# EAGLE design dali_adapter (EAGLE 9.5.2)
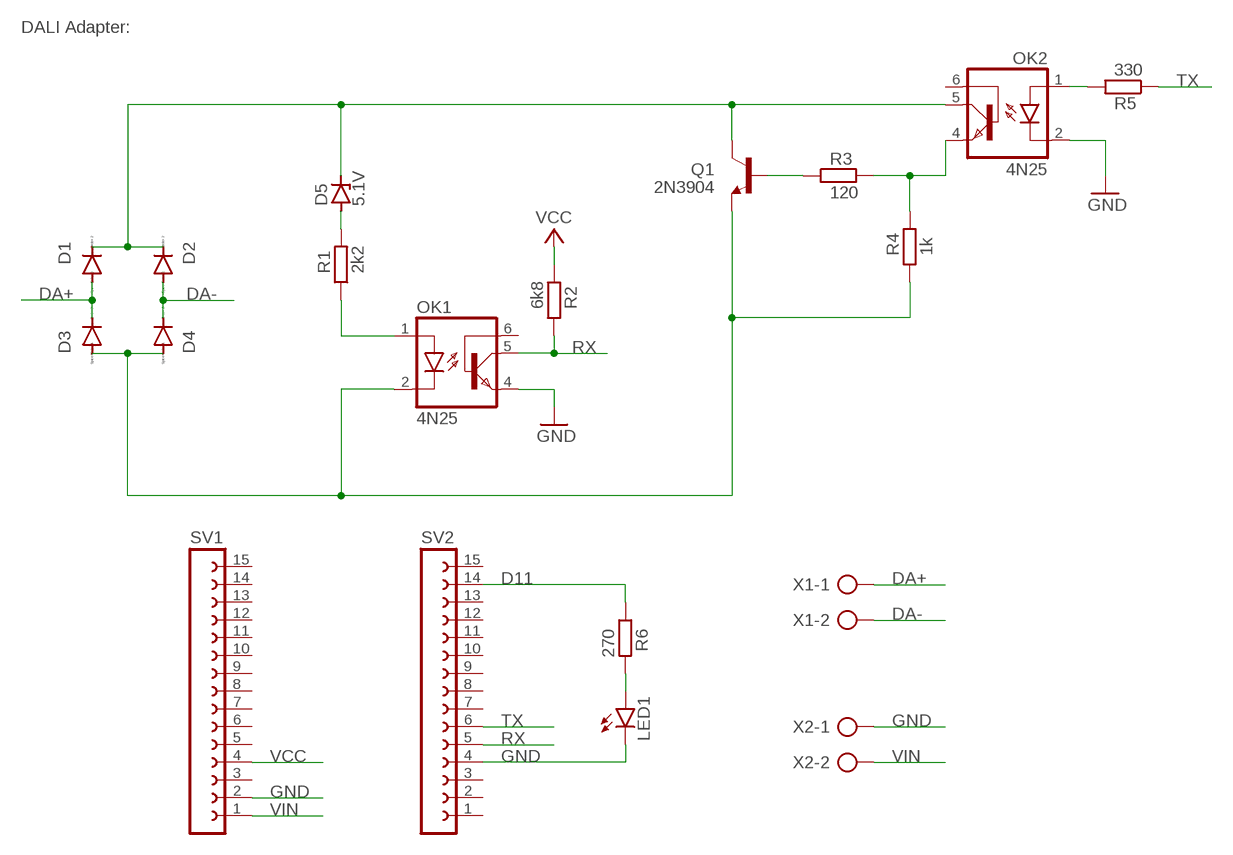
[diagram p0: schematic, sheet 1]

## Parts
D1  1N4004  [DO41-10]
D2  1N4004  [DO41-10]
D3  1N4004  [DO41-10]
D4  1N4004  [DO41-10]
D5  5.1V  ZENER-DIODEDO35Z10  [DO35Z10]
LED1  LED5MM  [LED5MM]
OK1  4N25  4N25M  [DIL06]
OK2  4N25  4N25M  [DIL06]
Q1  2N3904  BC449  [TO92-EBC]
R1  2k2  R-EU_0207/10  [0207/10]
R2  6k8  R-EU_0207/10  [0207/10]
R3  120  R-EU_0207/10  [0207/10]
R4  1k  R-EU_0207/10  [0207/10]
R5  330  R-EU_0207/10  [0207/10]
R6  270  R-EU_0207/10  [0207/10]
SV1  FE15-1  [FE15]
SV2  FE15-1  [FE15]
X1  AK500/2  [AK500/2]
X2  AK500/2  [AK500/2]

## Nets
D11: R6.1 SV2.14
DA+: D1.A D3.C X1.1
DA-: D2.A D4.C X1.2
GND: LED1.K(C) OK1.4(EMI) OK2.2(C) SV1.2 SV2.4 X2.1
N$1: LED1.A R6.2
N$3: D3.A D4.A OK1.2(C) Q1.E R4.1
N$4: OK1.1(A) R1.1
N$5: OK2.4(EMI) R3.2 R4.2
N$6: Q1.B R3.1
N$7: OK2.1(A) R5.2
N$9: D5.A R1.2
N$13: D1.C D2.C D5.C OK2.5(COL) Q1.C
RX: OK1.5(COL) R2.2 SV2.5
TX: R5.1 SV2.6
VCC: R2.1 SV1.4
VIN: SV1.1 X2.2
Unconnected: OK1.6(BAS) OK2.6(BAS) SV1.3 SV1.5 SV1.6 SV1.7 SV1.8 SV1.9 SV1.10 SV1.11 SV1.12 SV1.13 SV1.14 SV1.15 SV2.1 SV2.2 SV2.3 SV2.7 SV2.8 SV2.9 SV2.10 SV2.11 SV2.12 SV2.13 SV2.15

## Notes on the sheet
- DALI Adapter:

## Library data of the parts
D1-D4 = diode:1N4004: DIODE general purpose rectifier, 1 A
D5 = diode:ZENER-DIODE: Z-Diode
LED1 = led:LED: LED OSRAM: - CHIPLED LG R971, LG N971, LY N971, LG Q971, LY Q971, LO R971, LY R971 LH N974, LH R974 LS Q976, LO Q976, LY Q976 LO Q996 - Hyper CHIPLED LW Q18S LB Q993, LB Q99A, LB R99A - SideLED LS A670, LO A670, LY A670, LG A670, LP A670 LB A673, LV A673, LT A673, LW A673 LH A674 LY A675 LS A676, LA A676, LO A676, LY A676, LW A676 LS A679, LY A679, LG A679 - Hyper Micro SIDELED® LS Y876, LA Y876, LO Y876, LY Y876 LT Y87S - SmartLED LW L88C, LW L88S LB L89C, LB L89S, LG L890 LS L89K, LO L89K, LY L89K LS L896, LA L896, LO L896, LY L896 - TOPLED LS T670, LO T670, LY T670, LG T670, LP T670 LSG T670, LSP T670, LSY T670, LOP T670, LYG T670 LG T671, LOG T671, LSG T671 LB T673, LV T673, LT T673, LW T673 LH T674 LS T676, LA T676, LO T676, LY T676, LB T676, LH T676, LSB T676, LW T676 LB T67C, LV T67C, LT T67C, LS T67K, LO T67K, LY T67K, LW E67C LS E67B, LA E67B, LO E67B, LY E67B, LB E67C, LV E67C, LT E67C LW T67C LS T679, LY T679, LG T679 LS T770, LO T770, LY T770, LG T770, LP T770 LB T773, LV T773, LT T773, LW T773 LH T774 LS E675, LA E675, LY E675, LS T675 LS T776, LA T776, LO T776, LY T776, LB T776 LHGB T686 LT T68C, LB T68C - Hyper Mini TOPLED® LB M676 - Mini TOPLED Santana® LG M470 LS M47K, LO M47K, LY M47K Source: http://www.osram.convergy.de LUXEON: - LUMILED® LXK2-PW12-R00, LXK2-PW12-S00, LXK2-PW14-U00, LXK2-PW14-V00 LXK2-PM12-R00, LXK2-PM12-S00, LXK2-PM14-U00 LXK2-PE12-Q00, LXK2-PE12-R00, LXK2-PE12-S00, LXK2-PE14-T00, LXK2-PE14-U00 LXK2-PB12-K00, LXK2-PB12-L00, LXK2-PB12-M00, LXK2-PB14-N00, LXK2-PB14-P00, LXK2-PB14-Q00 LXK2-PR12-L00, LXK2-PR12-M00, LXK2-PR14-Q00, LXK2-PR14-R00 LXK2-PD12-Q00, LXK2-PD12-R00, LXK2-PD12-S00 LXK2-PH12-R00, LXK2-PH12-S00 LXK2-PL12-P00, LXK2-PL12-Q00, LXK2-PL12-R00 Source: www.luxeon.com KINGBRIGHT: KA-3528ASYC Source: www.kingbright.com
OK1 OK2 = optocoupler:4N*?M: General Purpose 6-Pin Phototransistor Optocouplers Source: http://www.fairchildsemi.com/ds/4N/4N35-M.pdf; MPN: 4N25-M; OC_FARNELL: 1021349; OC_NEWARK: 98K9084
Q1 = transistor-npn:BC449*: NPN Transistor
R1-R6 = rcl:R-EU_: RESISTOR, European symbol; SPICEPREFIX: R
SV1 SV2 = con-lsta:FE15-1: FEMALE HEADER; OC_FARNELL: unknown; OC_NEWARK: unknown
X1 X2 = con-ptr500:AK500/2: CONNECTOR; OC_FARNELL: unknown; OC_NEWARK: unknown

## Board
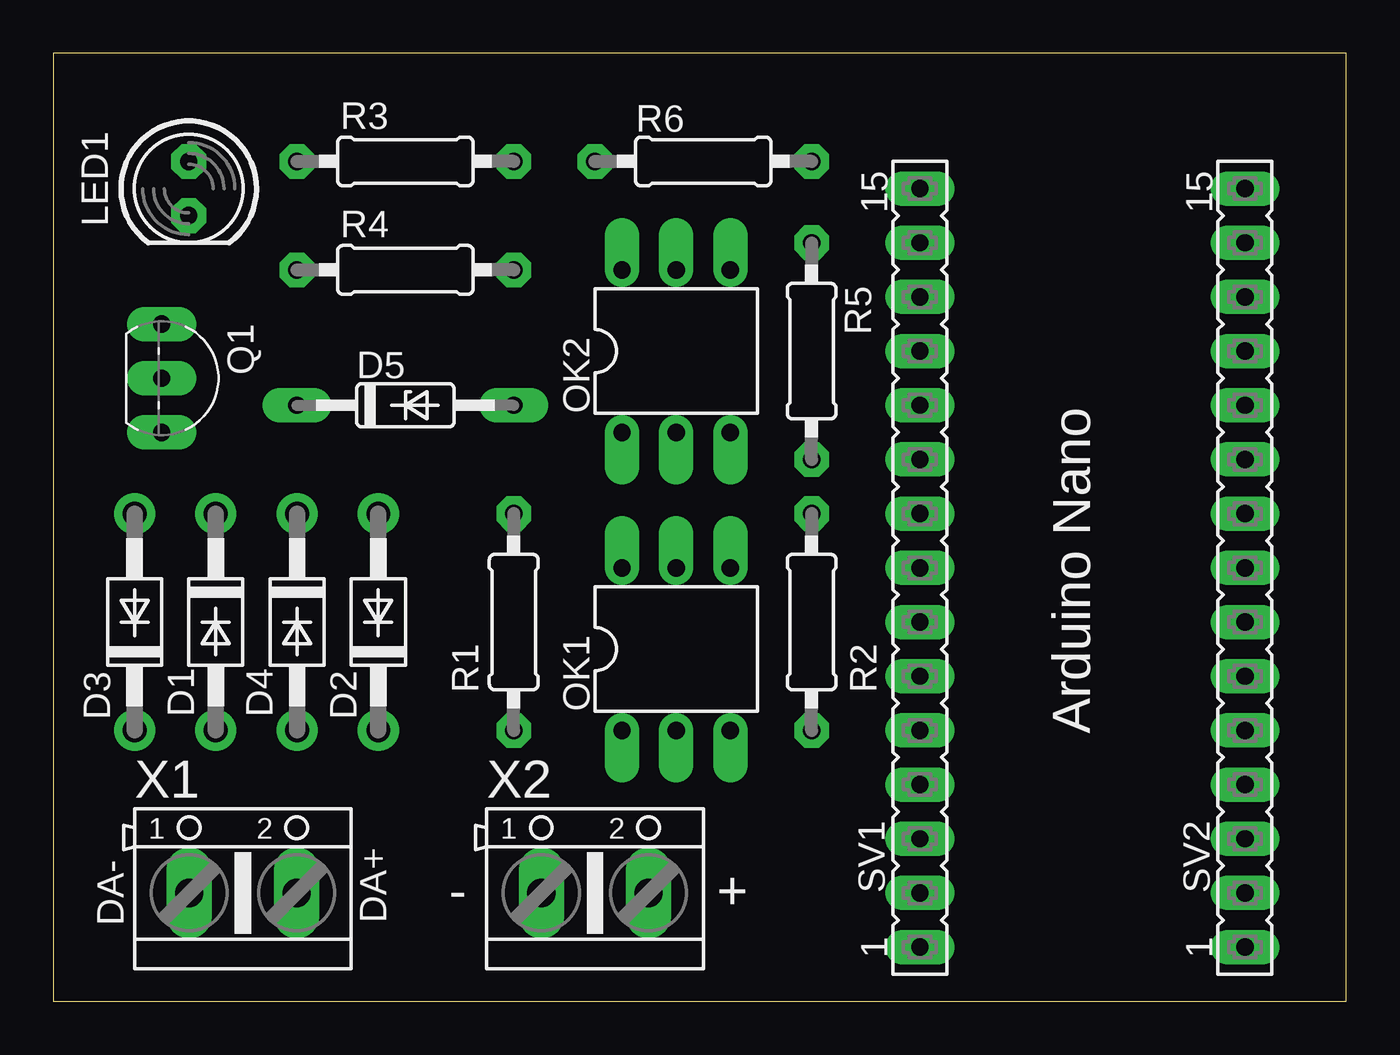
[diagram p1: board, top side]
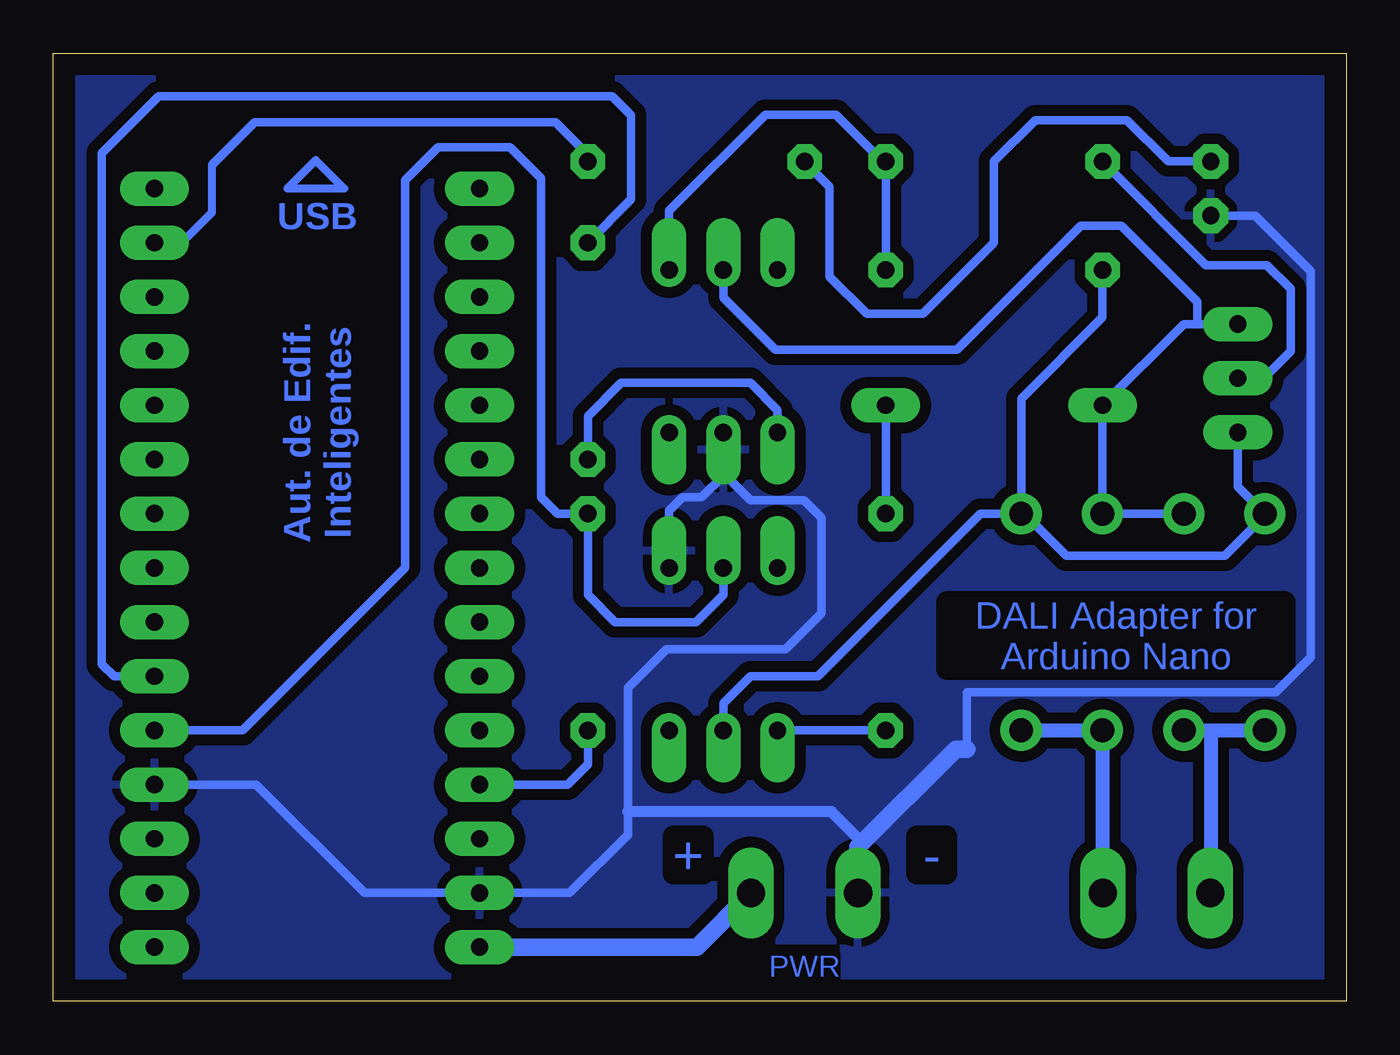
[diagram p2: board, bottom side, seen from below]

Size 60.63 x 44.44 mm. Coordinates in mm from the lower left corner, seen from the top.
Outline: 0,0 60.63,0 60.63,44.44 0,44.44 0,0
Copper layers (1*16): Top 0.035mm / dielectric 1.5mm / Bottom 0.035mm
Design rules "default *": minimum track width 15mil, minimum drill 0.6mm, track to track 20mil, track to pad 20mil, pad to pad 20mil, via to via 6mil, smd to smd 6mil, copper to edge 40mil, drill to drill 6mil, minimum pad ring 16mil, minimum via ring 8mil, stop-mask expansion 4mil, vias tented up to drill 0mil, thermal gap 16mil

### Footprints (pad centres in the part's own frame; a part is rotated, then mirrored left to right if it is on the bottom)
DO41-10 = drill 1.118: A 5.08,0; C -5.08,0
DO35Z10 = drill 0.813 long: A 5.08,0; C -5.08,0
LED5MM = drill 0.813 octagon: A -1.27,0; K 1.27,0
DIL06 = drill 0.813 offset: 1 -2.54,-3.81; 2 0,-3.81; 3 2.54,-3.81; 4 2.54,3.81; 5 0,3.81; 6 -2.54,3.81
TO92-EBC = drill 0.813 long: B 0,-1.27; C -2.54,-1.27; E 2.54,-1.27
0207/10 = drill 0.813 octagon: 1 -5.08,0; 2 5.08,0
FE15 = drill 0.813 long: 1 -17.78,0; 2 -15.24,0; 3 -12.7,0; 4 -10.16,0; 5 -7.62,0; 6 -5.08,0; 7 -2.54,0; 8 0,0; 9 2.54,0; 10 5.08,0; 11 7.62,0; 12 10.16,0; 13 12.7,0; 14 15.24,0; 15 17.78,0
AK500/2 = drill 1.321 long: 1 -2.515,0; 2 2.515,0

### Placement (x,y rotation side)
D1  7.62,17.78 270 top
D2  11.43,17.78 270 top
D3  3.81,17.78 90 top
D4  15.24,17.78 90 top
D5  16.51,27.94 0 top
LED1  6.35,38.1 270 top
OK1  29.21,16.51 0 top
OK2  29.21,30.48 0 top
Q1  6.35,29.21 270 top
R1  21.59,17.78 90 top
R2  35.56,17.78 90 top
R3  16.51,39.37 0 top
R4  16.51,34.29 0 top
R5  35.56,30.48 270 top
R6  30.48,39.37 180 top
SV1  40.64,20.32 90 top
SV2  55.88,20.32 90 top
X1  8.89,5.08 0 top
X2  25.4,5.08 0 top

### Tracks (layer width: path | path; a pad name or v marks a point on that pad's centre or on a via)
D11
  Bottom 0.381: SV2.14 54.61,35.56 53.18,36.99 53.18,39.21
  Bottom 0.406: R6.1 35.56,39.69 37.08,41.21 51.18,41.21 53.18,39.21
DA+
  Bottom 0.66: D1.A 6.35,12.7 | 6.35,12.7 D3.C | 6.35,12.7 6.35,5.08 X1.1
DA-
  Bottom 0.66: D4.C D2.A 11.43,5.08 X1.2
GND
  Bottom 0.406: 33.69,7.78 33.69,7.81 | 33.69,7.81 36.42,5.08 SV1.2 46.04,5.08 51.12,10.16 SV2.4 | LED1.K 4.25,36.83 1.65,34.23 1.65,16.13 3.3,14.48 17.78,14.48 17.78,11.81 | 31.75,22.35 OK1.4 31.75,22.99 31.11,23.62 30.23,23.62 29.21,24.64 OK2.2 29.21,24.77 27.94,23.5 25.43,23.5 24.61,22.67 24.61,18.19 26.29,16.51 31.88,16.51 33.69,14.7 33.69,8.89 33.69,7.81
  Bottom 0.508: X2.1 22.89,7.64 24.13,8.89 33.69,8.89
  Bottom 0.813: X2.1 22.89,7.24 18.31,11.81 17.78,11.81
  pour Bottom: -2.54,45.72 -2.54,-2.54 63.5,-2.54 63.5,45.72
N$1
  Bottom 0.406: LED1.A 8.35,39.37 10.29,41.31 14.57,41.31 16.51,39.37 16.51,35.56 19.84,32.23 22.48,32.23 24.23,33.97 24.23,38.2 R6.2
N$2
  Bottom 0.381: 46.99,38.1 49.66,38.1 48.32,39.43 46.99,38.1
N$3
  Bottom 0.406: Q1.E 5.08,24.13 D3.A 3.76,22.81 5.68,20.89 13.11,20.89 15.08,22.86 D4.A | R4.1 11.43,32.07 15.24,28.26 D4.A | OK1.2 29.21,13.97 27.94,15.24 24.77,15.24 17.14,22.86 D4.A
N$4
  Bottom 0.406: OK1.1 R1.1
N$5
  Bottom 0.406: R4.2 R3.2 21.75,39.37 23.94,41.56 27.24,41.56 31.75,37.05 OK2.4
N$6
  Bottom 0.406: Q1.B 3.87,29.21 2.6,30.48 2.6,33.4 3.71,34.51 6.57,34.51 R3.1
N$7
  Bottom 0.406: OK2.1 26.67,27.72 27.94,28.99 34,28.99 35.56,27.43 R5.2
N$9
  Bottom 0.406: D5.A R1.2
N$13
  Bottom 0.406: D1.C D2.C D5.C 7.62,31.75 6.99,31.75 | 6.99,31.75 Q1.C | OK2.5 29.21,32.99 26.77,30.54 18.26,30.54 12.45,36.35 10.54,36.35 6.99,32.8 6.99,31.75
RX
  Bottom 0.406: SV2.5 51.75,12.7 44.13,20.32 44.13,38.48 42.58,40.04 39.21,40.04 37.75,38.58 37.75,23.62 36.99,22.86 R2.2 35.56,19.05 34.29,17.78 30.48,17.78 29.21,19.05 OK1.5
TX
  Bottom 0.406: SV2.6 57.78,15.24 58.36,15.81 58.36,39.75 55.69,42.42 34.42,42.42 33.53,41.53 33.53,37.59 R5.1
VCC
  Bottom 0.406: SV1.4 36.51,10.16 35.56,11.11 R2.1
VIN
  Bottom 0.813: X2.2 30.45,2.54 SV1.1

### Text on the board
Bottom: USB | Aut. de Edif. / Inteligentes | DALI Adapter for / Arduino Nano | - | + | PWR
tPlace: Arduino Nano | DA- | DA+ | - | +